# EasyEDA Pro project BLDC_Driverv3.eprj, schematic Schematic1
Create Date: 2024-09-20; Page Name: P1; Project Name: BLDC_Driverv3; Schematic Name: Schematic1; Update Date: 2024-09-20; Company: EasyEDA.com; Drawn: EasyEDA; Page Size: A4; Part Number: JLCPCB-002; Reviewed: EasyEDA; Version: V0.1
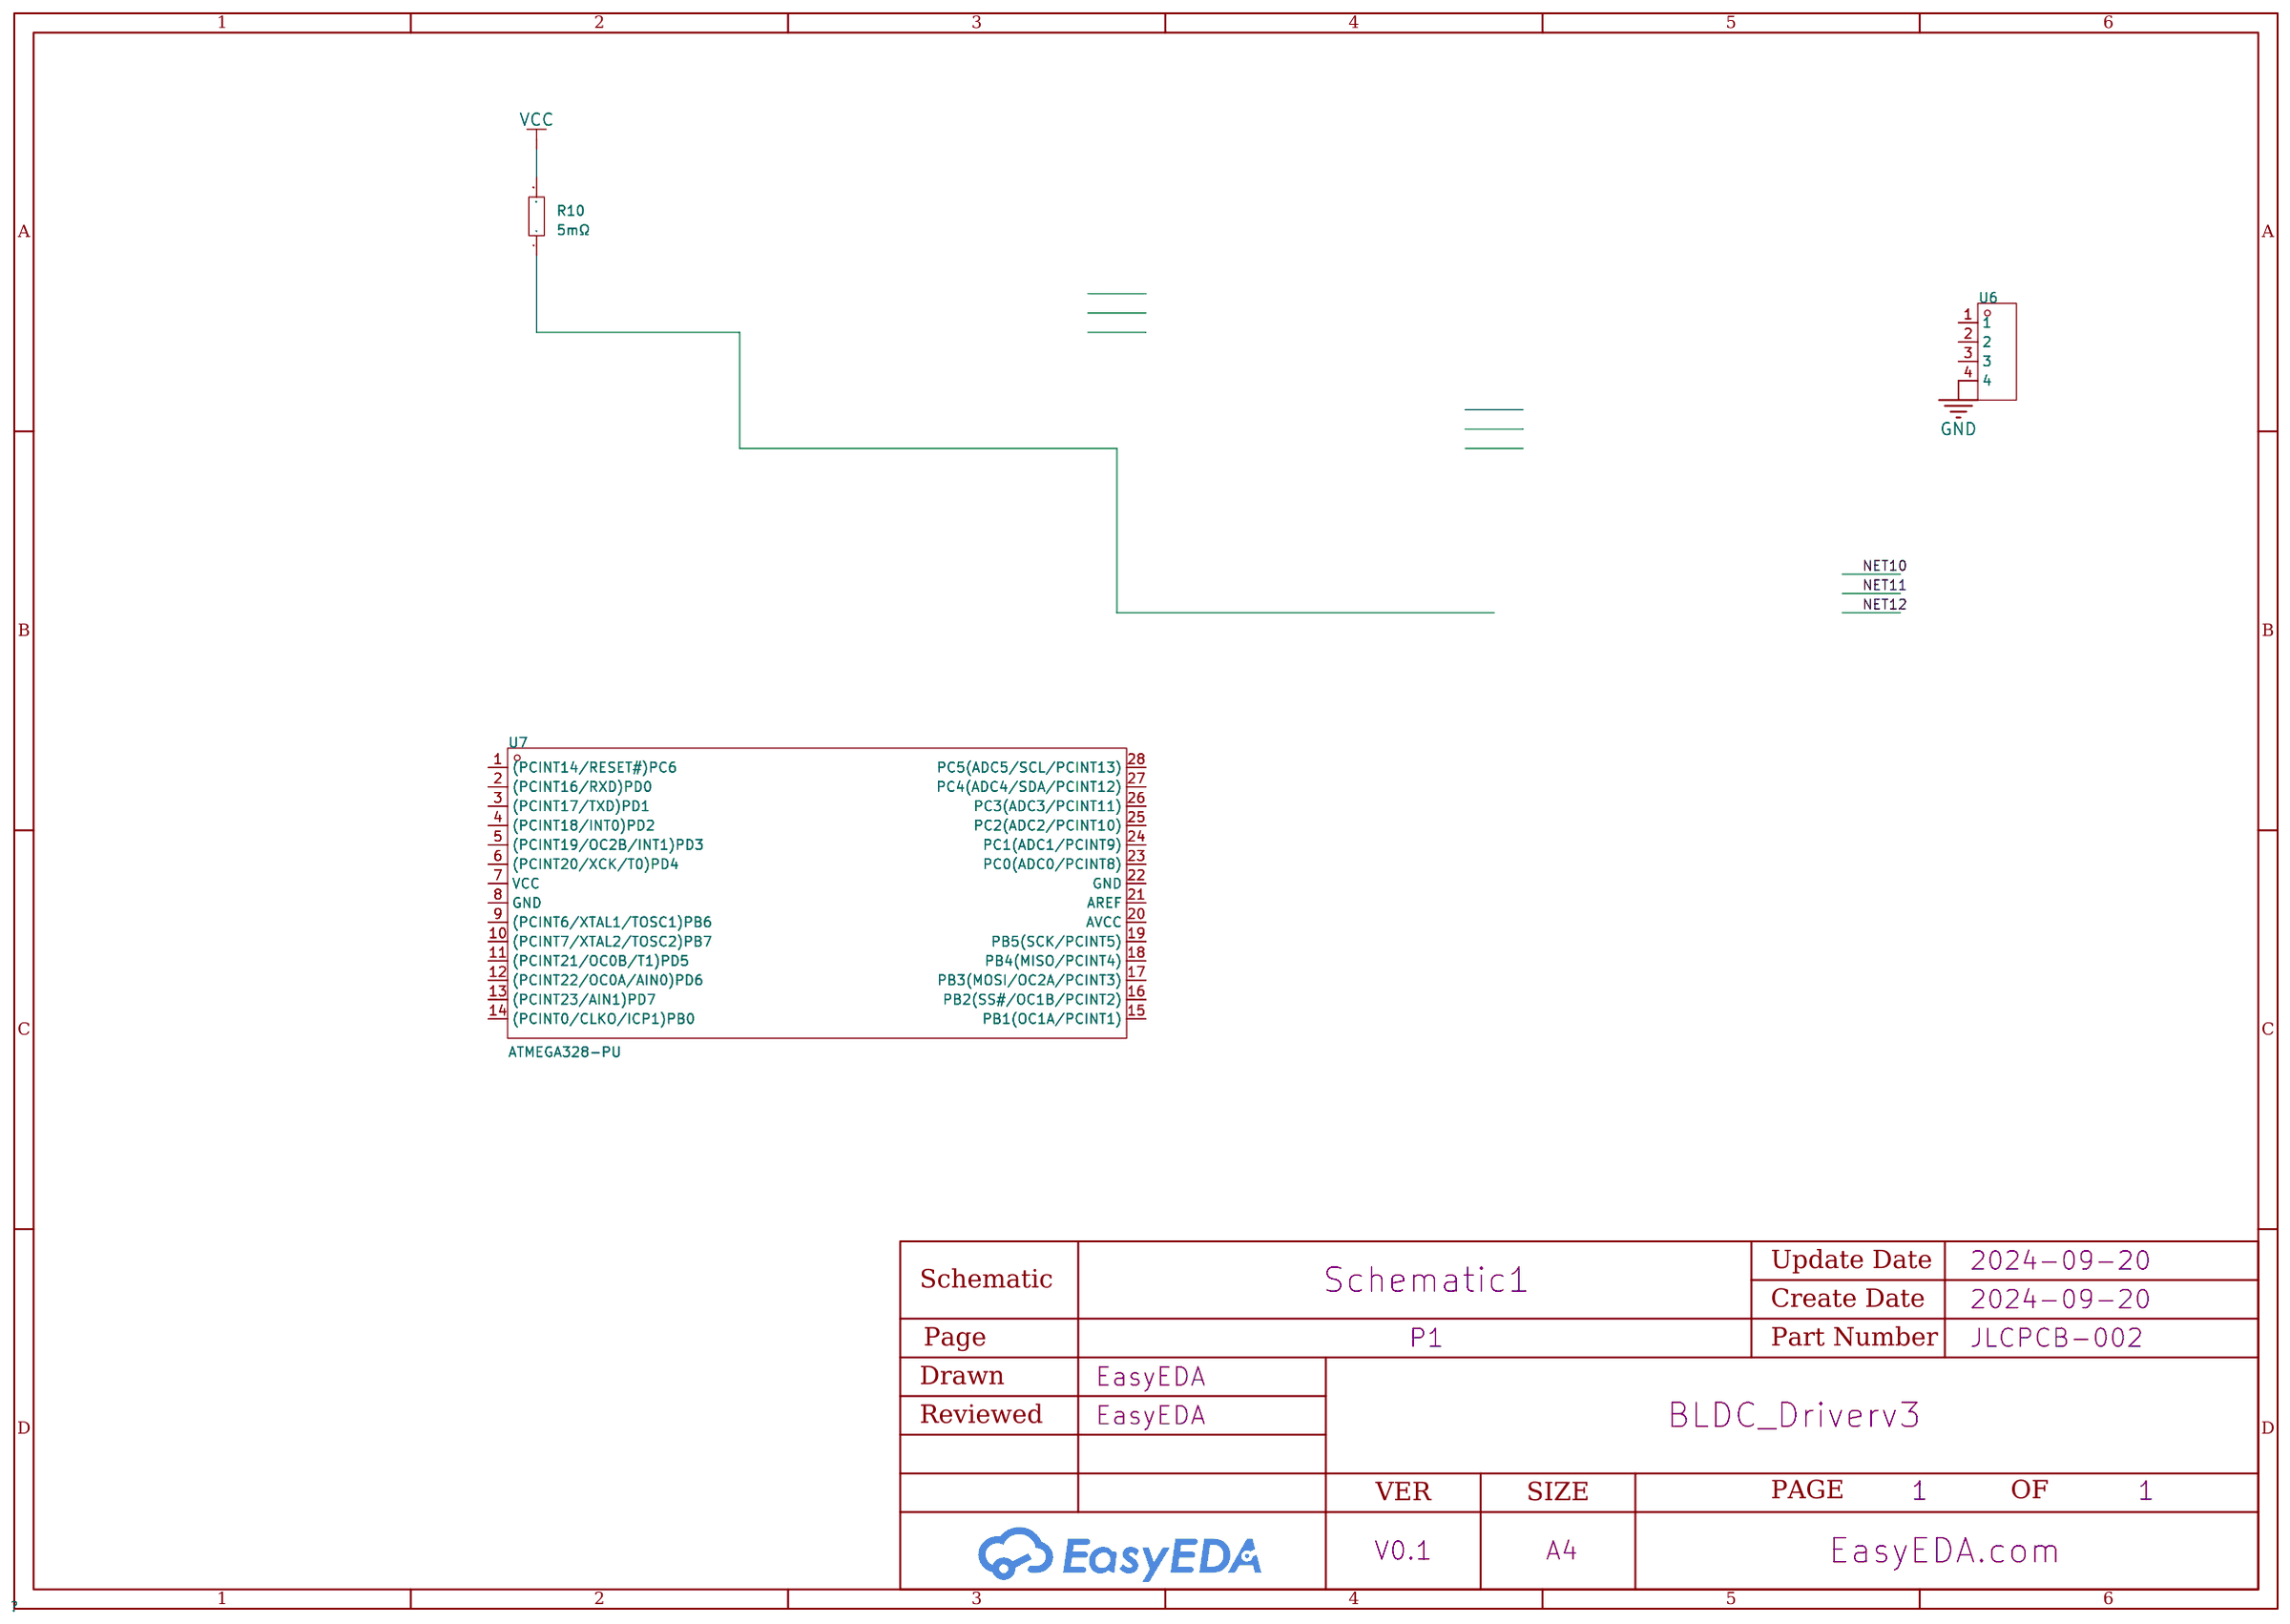
[diagram p0: schematic sheet]

## Parts
CBB1  PhaseA
CBB2  PhaseB
CBB3  PhaseC
R10  5mΩ  [R2512]
U6  15ETYVC-3.5-04P-14-00  [CONN-TH_4P-P3.50_TOPONELEC_15ETYVC-3.5-04P-14-00AH]
U7  ATMEGA328-PU  [DIP-28_L35.0-W6.5-P2.54-LS7.6-BL]

## Library data of the parts
R10 = PA2512FKF7W0R005E: Type:Current Sensing Resistors Resistance: Tolerance:±1% Tolerance:±1% Power(Watts): Temperature Coefficient:±100ppm/℃ Temperature Coefficient:±100ppm/℃; LCSC Part Name: 5mΩ ±1% 2W; Supplier Part: C309526; Manufacturer: YAGEO(国巨); Supplier Footprint: 2512; JLCPCB Part Class: Extended Part; Datasheet: https://atta.szlcsc.com/upload/public/pdf/source/20190227/C375693_219964CC8B3EBD36DBDF701587FA5938.pdf; Supplier: LCSC; Type: Current Sensing Resistors; Tolerance: ±1%; Temperature Coefficient: ±100ppm/℃
U6 = 15ETYVC-3.5-04P-14-00: LCSC Part Name: Toponelec(上海拓宜)端子，3.5mm间距连接器直针插座不带法兰; Supplier Part: C22387635; Manufacturer: Toponelec(拓宜); Supplier Footprint: 插件,P=3.5mm; JLCPCB Part Class: Extended Part; Datasheet: https://atta.szlcsc.com/upload/public/pdf/source/20240425/18F562A3E4003117F60A5CD07DD87476.pdf; Supplier: LCSC
U7 = ATMEGA328-PU: CPU Core:AVR Program Storage Size:32KB GPIO Ports Number:23 Operating Voltage Range:1.8V~5.5V Operating Voltage Range:1.8V~5.5V CPU Maximum Speed:20MHz Operating Temperature Range:-40℃~+85℃ Operating Temperature Range:-40℃~+85℃ ADC (Bit):10bit Watchdog:有; LCSC Part Name: 基于AVR增强型RISC架构的低功耗CMOS 8位微控制器; Supplier Part: C613508; Manufacturer: MICROCHIP(美国微芯); Supplier Footprint: PDIP-28; JLCPCB Part Class: Extended Part; Datasheet: https://atta.szlcsc.com/upload/public/pdf/source/20210120/C613508_D57921F38AD005C89F39DE8123071AEB.pdf; Supplier: LCSC; CPU Core: AVR; Program Storage Size: 32KB; GPIO Ports Number: 23; Operating Voltage Range: 1.8V~5.5V; CPU Maximum Speed: 20MHz; Operating Temperature Range: -40℃~+85℃; ADC (Bit): 10bit; Watchdog: 有; Low-Voltage Detect: 有; Internal Oscillator: 有

## Nets
GND: U6.4
VCC: R10.2
NET10: CBB1.(POWER) CBB2.(POWER) CBB3.(POWER) R10.1

Not connected (* = marked no-connect by the designer): U6 1 2 3; U7 1((PCINT14/RESET#)PC6) 2((PCINT16/RXD)PD0) 3((PCINT17/TXD)PD1) 4((PCINT18/INT0)PD2) 5((PCINT19/OC2B/INT1)PD3) 6((PCINT20/XCK/T0)PD4) 7(VCC) 8(GND) 9((PCINT6/XTAL1/TOSC1)PB6) 10((PCINT7/XTAL2/TOSC2)PB7) 11((PCINT21/OC0B/T1)PD5) 12((PCINT22/OC0A/AIN0)PD6) 13((PCINT23/AIN1)PD7) 14((PCINT0/CLKO/ICP1)PB0) 15(PB1(OC1A/PCINT1)) 16(PB2(SS#/OC1B/PCINT2)) 17(PB3(MOSI/OC2A/PCINT3)) 18(PB4(MISO/PCINT4)) 19(PB5(SCK/PCINT5)) 20(AVCC) 21(AREF) 22(GND) 23(PC0(ADC0/PCINT8)) 24(PC1(ADC1/PCINT9)) 25(PC2(ADC2/PCINT10)) 26(PC3(ADC3/PCINT11)) 27(PC4(ADC4/SDA/PCINT12)) 28(PC5(ADC5/SCL/PCINT13))
